# EAGLE schematic simple-hat (EAGLE 6.6.0)
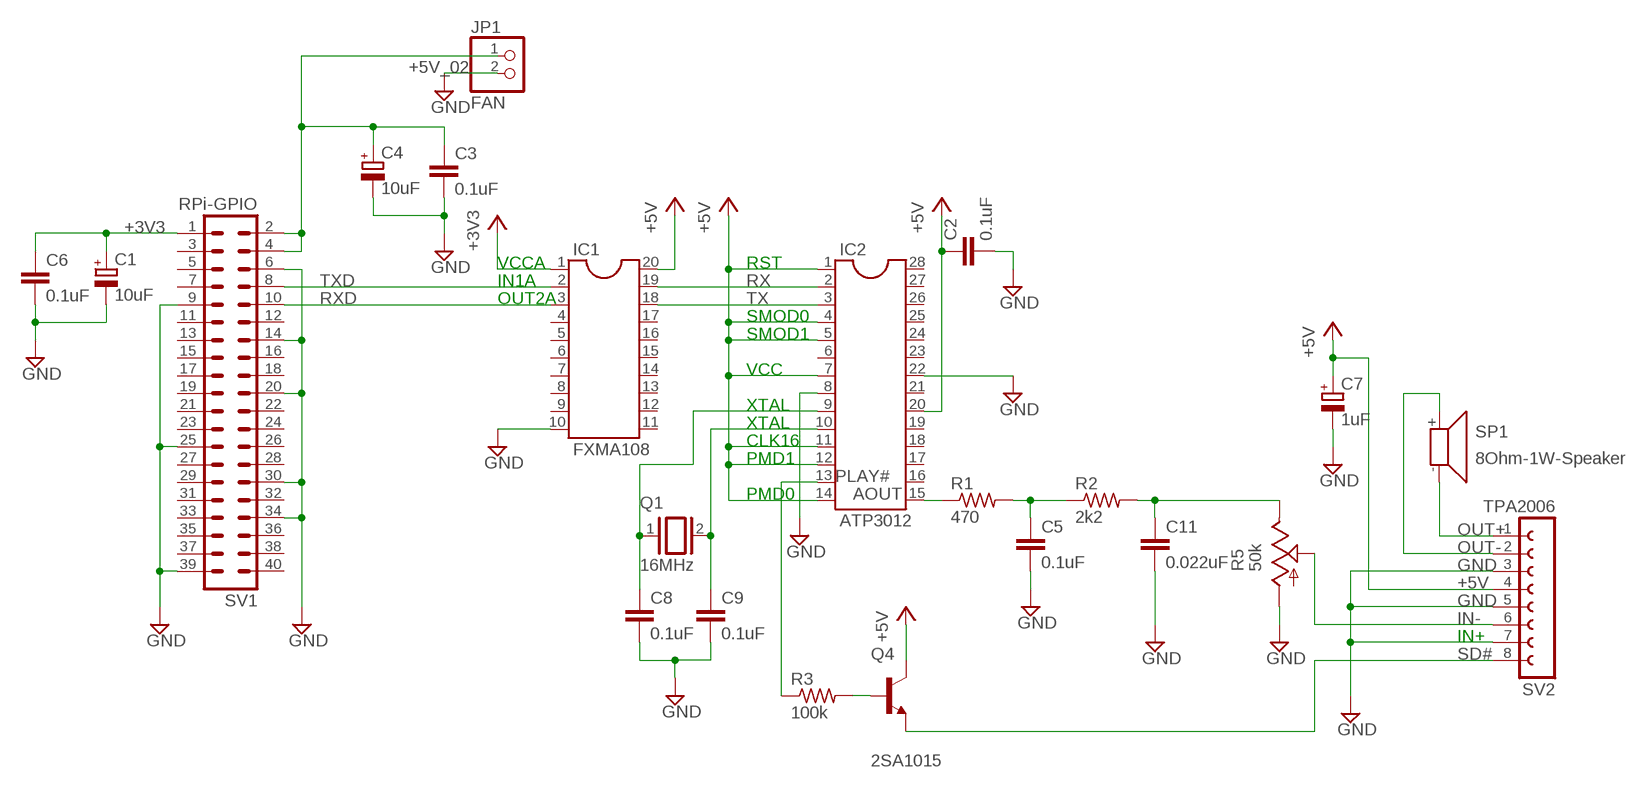
[diagram p0: schematic, sheet 1]

## Parts
C1  10uF  CPOL-EUE2-5  [E2-5]
C2  0.1uF  C-EU025-025X050  [C025-025X050]
C3  0.1uF  C-EU025-025X050  [C025-025X050]
C4  10uF  CPOL-EUE2-5  [E2-5]
C5  0.1uF  C-EU025-025X050  [C025-025X050]
C6  0.1uF  C-EU025-025X050  [C025-025X050]
C7  1uF  CPOL-EUE5-10.5  [E5-10,5]
C8  0.1uF  C-EU025-025X050  [C025-025X050]
C9  0.1uF  C-EU025-025X050  [C025-025X050]
C11  0.022uF  C-EU025-025X050  [C025-025X050]
IC1  FXMA108  DIL20S  [SOCKET-20]
IC2  ATP3012  DIL28-4  [DIL28-4]
JP1  FAN  PINHD-1X2  [1X02]
Q1  16MHz  XTAL  [Q]
Q4  2SA1015  BC447  [TO92-EBC]
R1  470  R-US_0207/7  [0207/7]
R2  2k2  R-US_0207/7  [0207/7]
R3  100k  R-US_0207/7  [0207/7]
R5  50k  TRIM_US-B25P  [B25P]
SP1  8Ohm-1W-Speaker  SMS-1308MS-2-R  [SMS-1308MS-2-R]
SV1  RPi-GPIO  MA20-2  [MA20-2]
SV2  TPA2006  FE08W  [FE08W]

## Nets
+3V3: C1.+ C6.1 IC1.1 SV1.1
+5V: C2.1 C7.+ IC1.20 IC2.1 IC2.4 IC2.5 IC2.7 IC2.11 IC2.12 IC2.14 IC2.20 Q4.C SV2.4
+5V_02 [Power]: C3.1 C4.+ JP1.1 SV1.2 SV1.4
AOUT: IC2.15 R1.1
GND [GND]: C1.- C2.2 C3.2 C4.- C5.2 C6.2 C7.- C8.2 C9.2 C11.2 IC1.10 IC2.8 IC2.22 JP1.2 R5.A SV1.6 SV1.9 SV1.14 SV1.20 SV1.25 SV1.30 SV1.34 SV1.39 SV2.3 SV2.5 SV2.7
IN-: R5.S SV2.6
N$2: C9.1 IC2.10 Q1.2
N$3: C8.1 IC2.9 Q1.1
N$4: Q4.B R3.2
N$5: C5.1 R1.2 R2.1
N$7: C11.1 R2.2 R5.E
OUT+: SP1.- SV2.1
OUT-: SP1.+ SV2.2
PLAY#: IC2.13 R3.1
RX: IC1.19 IC2.2
RXD: IC1.3 SV1.10
SD#: Q4.E SV2.8
TX: IC1.18 IC2.3
TXD: IC1.2 SV1.8
Unconnected: IC1.4 IC1.5 IC1.6 IC1.7 IC1.8 IC1.9 IC1.11 IC1.12 IC1.13 IC1.14 IC1.15 IC1.16 IC1.17 IC2.6 IC2.16 IC2.17 IC2.18 IC2.19 IC2.21 IC2.23 IC2.24 IC2.25 IC2.26 IC2.27 IC2.28 SV1.3 SV1.5 SV1.7 SV1.11 SV1.12 SV1.13 SV1.15 SV1.16 SV1.17 SV1.18 SV1.19 SV1.21 SV1.22 SV1.23 SV1.24 SV1.26 SV1.27 SV1.28 SV1.29 SV1.31 SV1.32 SV1.33 SV1.35 SV1.36 SV1.37 SV1.38 SV1.40

## Notes on the sheet
- VCCA | RST
- IN1A
- OUT2A
- SMOD0
- SMOD1
- VCC
- XTAL
- XTAL
- CLK16
- PMD1
- PMD0
- IN+

## Library data of the parts
C1 C4 C7 = resistor:CPOL-EU: POLARIZED CAPACITOR, European symbol
C2 C3 C5 C6 C8 C9 C11 = resistor:C-EU: CAPACITOR, European symbol
IC1 = ic-package:DIL20: Dual In Line / Socket
IC2 = ic-package:DIL28: Dual In Line
JP1 = pinhead:PINHD-1X2: PIN HEADER
Q1 = special:XTAL: CRYSTAL
Q4 = transistor-npn:BC447*: NPN Transistor
R1-R3 = resistor:R-US_: RESISTOR, American symbol
R5 = pot:TRIM_US-: POTENTIOMETER
SP1 = speaker:SMS-1308MS-2-R: Speaker 13 x 13mm, 8 Ohm, 0.7W Source: pui audio inc. SMS-1308MS-2-R.pdf
SV1 = con-lstb:MA20-2: PIN HEADER; OC_FARNELL: unknown; OC_NEWARK: unknown
SV2 = con-lsta:FE08W: FEMALE HEADER; OC_FARNELL: unknown; OC_NEWARK: unknown

## Net classes
0 default: width 0.61 mm, clearance 0.508 mm
1 Power: width 0.914 mm, clearance 0.508 mm
2 GND: width 0.813 mm, clearance 0.508 mm